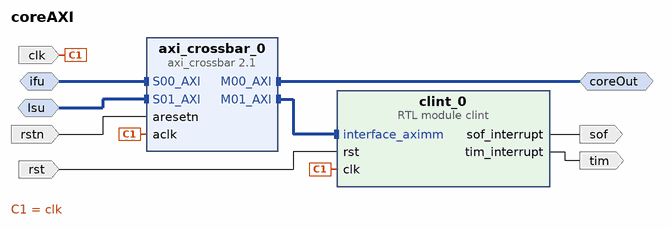
[diagram p0: block diagram of the top level]
# Vivado block design coreAXI, xc7a100tfgg484-1, Vivado 2023.2
create_bd_design coreAXI

create_bd_intf_port -mode Slave -vlnv xilinx.com:interface:aximm_rtl:1.0 ifu
set_property -dict [list \
  CONFIG.ADDR_WIDTH 32 \
  CONFIG.ARUSER_WIDTH 0 \
  CONFIG.AWUSER_WIDTH 0 \
  CONFIG.BUSER_WIDTH 0 \
  CONFIG.DATA_WIDTH 32 \
  CONFIG.FREQ_HZ 50000000 \
  CONFIG.HAS_BRESP 0 \
  CONFIG.HAS_BURST 0 \
  CONFIG.HAS_CACHE 0 \
  CONFIG.HAS_LOCK 0 \
  CONFIG.HAS_PROT 0 \
  CONFIG.HAS_QOS 0 \
  CONFIG.HAS_REGION 0 \
  CONFIG.HAS_RRESP 0 \
  CONFIG.HAS_WSTRB 1 \
  CONFIG.ID_WIDTH 0 \
  CONFIG.MAX_BURST_LENGTH 1 \
  CONFIG.NUM_READ_OUTSTANDING 0 \
  CONFIG.NUM_READ_THREADS 1 \
  CONFIG.NUM_WRITE_OUTSTANDING 0 \
  CONFIG.NUM_WRITE_THREADS 1 \
  CONFIG.PROTOCOL AXI4LITE \
  CONFIG.READ_WRITE_MODE READ_ONLY \
  CONFIG.RUSER_BITS_PER_BYTE 0 \
  CONFIG.RUSER_WIDTH 0 \
  CONFIG.SUPPORTS_NARROW_BURST 0 \
  CONFIG.WUSER_BITS_PER_BYTE 0 \
  CONFIG.WUSER_WIDTH 0 \
] [get_bd_intf_ports ifu]
create_bd_intf_port -mode Slave -vlnv xilinx.com:interface:aximm_rtl:1.0 lsu
set_property -dict [list \
  CONFIG.ADDR_WIDTH 32 \
  CONFIG.ARUSER_WIDTH 0 \
  CONFIG.AWUSER_WIDTH 0 \
  CONFIG.BUSER_WIDTH 0 \
  CONFIG.DATA_WIDTH 32 \
  CONFIG.FREQ_HZ 50000000 \
  CONFIG.HAS_BRESP 0 \
  CONFIG.HAS_BURST 0 \
  CONFIG.HAS_CACHE 0 \
  CONFIG.HAS_LOCK 0 \
  CONFIG.HAS_PROT 0 \
  CONFIG.HAS_QOS 0 \
  CONFIG.HAS_REGION 0 \
  CONFIG.HAS_RRESP 0 \
  CONFIG.HAS_WSTRB 1 \
  CONFIG.ID_WIDTH 0 \
  CONFIG.MAX_BURST_LENGTH 1 \
  CONFIG.NUM_READ_OUTSTANDING 0 \
  CONFIG.NUM_READ_THREADS 1 \
  CONFIG.NUM_WRITE_OUTSTANDING 0 \
  CONFIG.NUM_WRITE_THREADS 1 \
  CONFIG.PROTOCOL AXI4LITE \
  CONFIG.READ_WRITE_MODE READ_WRITE \
  CONFIG.RUSER_BITS_PER_BYTE 0 \
  CONFIG.RUSER_WIDTH 0 \
  CONFIG.SUPPORTS_NARROW_BURST 0 \
  CONFIG.WUSER_BITS_PER_BYTE 0 \
  CONFIG.WUSER_WIDTH 0 \
] [get_bd_intf_ports lsu]
create_bd_intf_port -mode Master -vlnv xilinx.com:interface:aximm_rtl:1.0 coreOut
set_property -dict [list \
  CONFIG.ADDR_WIDTH 32 \
  CONFIG.DATA_WIDTH 32 \
  CONFIG.FREQ_HZ 50000000 \
  CONFIG.HAS_BRESP 0 \
  CONFIG.HAS_PROT 0 \
  CONFIG.HAS_RRESP 0 \
  CONFIG.NUM_READ_OUTSTANDING 0 \
  CONFIG.NUM_WRITE_OUTSTANDING 0 \
  CONFIG.PROTOCOL AXI4LITE \
] [get_bd_intf_ports coreOut]
create_bd_port -dir I -type clk clk
set_property -dict {CONFIG.FREQ_HZ 50000000} [get_bd_ports clk]
create_bd_port -dir I -type rst rstn
create_bd_port -dir O sof
create_bd_port -dir O tim
create_bd_port -dir I -type rst rst
set_property -dict {CONFIG.POLARITY ACTIVE_HIGH} [get_bd_ports rst]

create_bd_cell -type ip -vlnv xilinx.com:ip:axi_crossbar:2.1 axi_crossbar_0
set_property -dict [list \
  CONFIG.M00_A02_BASE_ADDR 0xffffffffffffffff \
  CONFIG.M00_A03_BASE_ADDR 0xffffffffffffffff \
  CONFIG.M00_A04_BASE_ADDR 0xffffffffffffffff \
  CONFIG.M00_A05_BASE_ADDR 0xffffffffffffffff \
  CONFIG.M00_A06_BASE_ADDR 0xffffffffffffffff \
  CONFIG.M00_A07_BASE_ADDR 0xffffffffffffffff \
  CONFIG.M00_A08_BASE_ADDR 0xffffffffffffffff \
  CONFIG.M00_A09_BASE_ADDR 0xffffffffffffffff \
  CONFIG.M00_A10_BASE_ADDR 0xffffffffffffffff \
  CONFIG.M00_A11_BASE_ADDR 0xffffffffffffffff \
  CONFIG.M00_A12_BASE_ADDR 0xffffffffffffffff \
  CONFIG.M00_A13_BASE_ADDR 0xffffffffffffffff \
  CONFIG.M00_A14_BASE_ADDR 0xffffffffffffffff \
  CONFIG.M00_A15_BASE_ADDR 0xffffffffffffffff \
  CONFIG.M01_A01_BASE_ADDR 0xffffffffffffffff \
  CONFIG.M01_A02_BASE_ADDR 0xffffffffffffffff \
  CONFIG.M01_A03_BASE_ADDR 0xffffffffffffffff \
  CONFIG.M01_A04_BASE_ADDR 0xffffffffffffffff \
  CONFIG.M01_A05_BASE_ADDR 0xffffffffffffffff \
  CONFIG.M01_A06_BASE_ADDR 0xffffffffffffffff \
  CONFIG.M01_A07_BASE_ADDR 0xffffffffffffffff \
  CONFIG.M01_A08_BASE_ADDR 0xffffffffffffffff \
  CONFIG.M01_A09_BASE_ADDR 0xffffffffffffffff \
  CONFIG.M01_A10_BASE_ADDR 0xffffffffffffffff \
  CONFIG.M01_A11_BASE_ADDR 0xffffffffffffffff \
  CONFIG.M01_A12_BASE_ADDR 0xffffffffffffffff \
  CONFIG.M01_A13_BASE_ADDR 0xffffffffffffffff \
  CONFIG.M01_A14_BASE_ADDR 0xffffffffffffffff \
  CONFIG.M01_A15_BASE_ADDR 0xffffffffffffffff \
  CONFIG.M02_A00_ADDR_WIDTH 0 \
  CONFIG.M02_A00_BASE_ADDR 0xffffffffffffffff \
  CONFIG.M02_A01_BASE_ADDR 0xffffffffffffffff \
  CONFIG.M02_A02_BASE_ADDR 0xffffffffffffffff \
  CONFIG.M02_A03_BASE_ADDR 0xffffffffffffffff \
  CONFIG.M02_A04_BASE_ADDR 0xffffffffffffffff \
  CONFIG.M02_A05_BASE_ADDR 0xffffffffffffffff \
  CONFIG.M02_A06_BASE_ADDR 0xffffffffffffffff \
  CONFIG.M02_A07_BASE_ADDR 0xffffffffffffffff \
  CONFIG.M02_A08_BASE_ADDR 0xffffffffffffffff \
  CONFIG.M02_A09_BASE_ADDR 0xffffffffffffffff \
  CONFIG.M02_A10_BASE_ADDR 0xffffffffffffffff \
  CONFIG.M02_A11_BASE_ADDR 0xffffffffffffffff \
  CONFIG.M02_A12_BASE_ADDR 0xffffffffffffffff \
  CONFIG.M02_A13_BASE_ADDR 0xffffffffffffffff \
  CONFIG.M02_A14_BASE_ADDR 0xffffffffffffffff \
  CONFIG.M02_A15_BASE_ADDR 0xffffffffffffffff \
  CONFIG.M02_READ_ISSUING 1 \
  CONFIG.M02_WRITE_ISSUING 1 \
  CONFIG.M03_A00_ADDR_WIDTH 0 \
  CONFIG.M03_A00_BASE_ADDR 0xffffffffffffffff \
  CONFIG.M03_A01_BASE_ADDR 0xffffffffffffffff \
  CONFIG.M03_A02_BASE_ADDR 0xffffffffffffffff \
  CONFIG.M03_A03_BASE_ADDR 0xffffffffffffffff \
  CONFIG.M03_A04_BASE_ADDR 0xffffffffffffffff \
  CONFIG.M03_A05_BASE_ADDR 0xffffffffffffffff \
  CONFIG.M03_A06_BASE_ADDR 0xffffffffffffffff \
  CONFIG.M03_A07_BASE_ADDR 0xffffffffffffffff \
  CONFIG.M03_A08_BASE_ADDR 0xffffffffffffffff \
  CONFIG.M03_A09_BASE_ADDR 0xffffffffffffffff \
  CONFIG.M03_A10_BASE_ADDR 0xffffffffffffffff \
  CONFIG.M03_A11_BASE_ADDR 0xffffffffffffffff \
  CONFIG.M03_A12_BASE_ADDR 0xffffffffffffffff \
  CONFIG.M03_A13_BASE_ADDR 0xffffffffffffffff \
  CONFIG.M03_A14_BASE_ADDR 0xffffffffffffffff \
  CONFIG.M03_A15_BASE_ADDR 0xffffffffffffffff \
  CONFIG.M03_READ_ISSUING 1 \
  CONFIG.M03_WRITE_ISSUING 1 \
  CONFIG.M04_A00_ADDR_WIDTH 0 \
  CONFIG.M04_A00_BASE_ADDR 0xffffffffffffffff \
  CONFIG.M04_A01_BASE_ADDR 0xffffffffffffffff \
  CONFIG.M04_A02_BASE_ADDR 0xffffffffffffffff \
  CONFIG.M04_A03_BASE_ADDR 0xffffffffffffffff \
  CONFIG.M04_A04_BASE_ADDR 0xffffffffffffffff \
  CONFIG.M04_A05_BASE_ADDR 0xffffffffffffffff \
  CONFIG.M04_A06_BASE_ADDR 0xffffffffffffffff \
  CONFIG.M04_A07_BASE_ADDR 0xffffffffffffffff \
  CONFIG.M04_A08_BASE_ADDR 0xffffffffffffffff \
  CONFIG.M04_A09_BASE_ADDR 0xffffffffffffffff \
  CONFIG.M04_A10_BASE_ADDR 0xffffffffffffffff \
  CONFIG.M04_A11_BASE_ADDR 0xffffffffffffffff \
  CONFIG.M04_A12_BASE_ADDR 0xffffffffffffffff \
  CONFIG.M04_A13_BASE_ADDR 0xffffffffffffffff \
  CONFIG.M04_A14_BASE_ADDR 0xffffffffffffffff \
  CONFIG.M04_A15_BASE_ADDR 0xffffffffffffffff \
  CONFIG.M04_READ_ISSUING 1 \
  CONFIG.M04_WRITE_ISSUING 1 \
  CONFIG.M05_A00_ADDR_WIDTH 0 \
  CONFIG.M05_A00_BASE_ADDR 0xffffffffffffffff \
  CONFIG.M05_A01_BASE_ADDR 0xffffffffffffffff \
  CONFIG.M05_A02_BASE_ADDR 0xffffffffffffffff \
  CONFIG.M05_A03_BASE_ADDR 0xffffffffffffffff \
  CONFIG.M05_A04_BASE_ADDR 0xffffffffffffffff \
  CONFIG.M05_A05_BASE_ADDR 0xffffffffffffffff \
  CONFIG.M05_A06_BASE_ADDR 0xffffffffffffffff \
  CONFIG.M05_A07_BASE_ADDR 0xffffffffffffffff \
  CONFIG.M05_A08_BASE_ADDR 0xffffffffffffffff \
  CONFIG.M05_A09_BASE_ADDR 0xffffffffffffffff \
  CONFIG.M05_A10_BASE_ADDR 0xffffffffffffffff \
  CONFIG.M05_A11_BASE_ADDR 0xffffffffffffffff \
  CONFIG.M05_A12_BASE_ADDR 0xffffffffffffffff \
  CONFIG.M05_A13_BASE_ADDR 0xffffffffffffffff \
  CONFIG.M05_A14_BASE_ADDR 0xffffffffffffffff \
  CONFIG.M05_A15_BASE_ADDR 0xffffffffffffffff \
  CONFIG.M05_READ_ISSUING 1 \
  CONFIG.M05_WRITE_ISSUING 1 \
  CONFIG.M06_A00_ADDR_WIDTH 0 \
  CONFIG.M06_A00_BASE_ADDR 0xffffffffffffffff \
  CONFIG.M06_A01_BASE_ADDR 0xffffffffffffffff \
  CONFIG.M06_A02_BASE_ADDR 0xffffffffffffffff \
  CONFIG.M06_A03_BASE_ADDR 0xffffffffffffffff \
  CONFIG.M06_A04_BASE_ADDR 0xffffffffffffffff \
  CONFIG.M06_A05_BASE_ADDR 0xffffffffffffffff \
  CONFIG.M06_A06_BASE_ADDR 0xffffffffffffffff \
  CONFIG.M06_A07_BASE_ADDR 0xffffffffffffffff \
  CONFIG.M06_A08_BASE_ADDR 0xffffffffffffffff \
  CONFIG.M06_A09_BASE_ADDR 0xffffffffffffffff \
  CONFIG.M06_A10_BASE_ADDR 0xffffffffffffffff \
  CONFIG.M06_A11_BASE_ADDR 0xffffffffffffffff \
  CONFIG.M06_A12_BASE_ADDR 0xffffffffffffffff \
  CONFIG.M06_A13_BASE_ADDR 0xffffffffffffffff \
  CONFIG.M06_A14_BASE_ADDR 0xffffffffffffffff \
  CONFIG.M06_A15_BASE_ADDR 0xffffffffffffffff \
  CONFIG.M06_READ_ISSUING 1 \
  CONFIG.M06_WRITE_ISSUING 1 \
  CONFIG.M07_A00_ADDR_WIDTH 0 \
  CONFIG.M07_A00_BASE_ADDR 0xffffffffffffffff \
  CONFIG.M07_A01_BASE_ADDR 0xffffffffffffffff \
  CONFIG.M07_A02_BASE_ADDR 0xffffffffffffffff \
  CONFIG.M07_A03_BASE_ADDR 0xffffffffffffffff \
  CONFIG.M07_A04_BASE_ADDR 0xffffffffffffffff \
  CONFIG.M07_A05_BASE_ADDR 0xffffffffffffffff \
  CONFIG.M07_A06_BASE_ADDR 0xffffffffffffffff \
  CONFIG.M07_A07_BASE_ADDR 0xffffffffffffffff \
  CONFIG.M07_A08_BASE_ADDR 0xffffffffffffffff \
  CONFIG.M07_A09_BASE_ADDR 0xffffffffffffffff \
  CONFIG.M07_A10_BASE_ADDR 0xffffffffffffffff \
  CONFIG.M07_A11_BASE_ADDR 0xffffffffffffffff \
  CONFIG.M07_A12_BASE_ADDR 0xffffffffffffffff \
  CONFIG.M07_A13_BASE_ADDR 0xffffffffffffffff \
  CONFIG.M07_A14_BASE_ADDR 0xffffffffffffffff \
  CONFIG.M07_A15_BASE_ADDR 0xffffffffffffffff \
  CONFIG.M07_READ_ISSUING 1 \
  CONFIG.M07_WRITE_ISSUING 1 \
  CONFIG.M08_A00_ADDR_WIDTH 0 \
  CONFIG.M08_A00_BASE_ADDR 0xffffffffffffffff \
  CONFIG.M08_A01_BASE_ADDR 0xffffffffffffffff \
  CONFIG.M08_A02_BASE_ADDR 0xffffffffffffffff \
  CONFIG.M08_A03_BASE_ADDR 0xffffffffffffffff \
  CONFIG.M08_A04_BASE_ADDR 0xffffffffffffffff \
  CONFIG.M08_A05_BASE_ADDR 0xffffffffffffffff \
  CONFIG.M08_A06_BASE_ADDR 0xffffffffffffffff \
  CONFIG.M08_A07_BASE_ADDR 0xffffffffffffffff \
  CONFIG.M08_A08_BASE_ADDR 0xffffffffffffffff \
  CONFIG.M08_A09_BASE_ADDR 0xffffffffffffffff \
  CONFIG.M08_A10_BASE_ADDR 0xffffffffffffffff \
  CONFIG.M08_A11_BASE_ADDR 0xffffffffffffffff \
  CONFIG.M08_A12_BASE_ADDR 0xffffffffffffffff \
  CONFIG.M08_A13_BASE_ADDR 0xffffffffffffffff \
  CONFIG.M08_A14_BASE_ADDR 0xffffffffffffffff \
  CONFIG.M08_A15_BASE_ADDR 0xffffffffffffffff \
  CONFIG.M08_READ_ISSUING 1 \
  CONFIG.M08_WRITE_ISSUING 1 \
  CONFIG.M09_A00_ADDR_WIDTH 0 \
  CONFIG.M09_A00_BASE_ADDR 0xffffffffffffffff \
  CONFIG.M09_A01_BASE_ADDR 0xffffffffffffffff \
  CONFIG.M09_A02_BASE_ADDR 0xffffffffffffffff \
  CONFIG.M09_A03_BASE_ADDR 0xffffffffffffffff \
  CONFIG.M09_A04_BASE_ADDR 0xffffffffffffffff \
  CONFIG.M09_A05_BASE_ADDR 0xffffffffffffffff \
  CONFIG.M09_A06_BASE_ADDR 0xffffffffffffffff \
  CONFIG.M09_A07_BASE_ADDR 0xffffffffffffffff \
  CONFIG.M09_A08_BASE_ADDR 0xffffffffffffffff \
  CONFIG.M09_A09_BASE_ADDR 0xffffffffffffffff \
  CONFIG.M09_A10_BASE_ADDR 0xffffffffffffffff \
  CONFIG.M09_A11_BASE_ADDR 0xffffffffffffffff \
  CONFIG.M09_A12_BASE_ADDR 0xffffffffffffffff \
  CONFIG.M09_A13_BASE_ADDR 0xffffffffffffffff \
  CONFIG.M09_A14_BASE_ADDR 0xffffffffffffffff \
  CONFIG.M09_A15_BASE_ADDR 0xffffffffffffffff \
  CONFIG.M09_READ_ISSUING 1 \
  CONFIG.M09_WRITE_ISSUING 1 \
  CONFIG.M10_A00_ADDR_WIDTH 0 \
  CONFIG.M10_A00_BASE_ADDR 0xffffffffffffffff \
  CONFIG.M10_A01_BASE_ADDR 0xffffffffffffffff \
  CONFIG.M10_A02_BASE_ADDR 0xffffffffffffffff \
  CONFIG.M10_A03_BASE_ADDR 0xffffffffffffffff \
  CONFIG.M10_A04_BASE_ADDR 0xffffffffffffffff \
  CONFIG.M10_A05_BASE_ADDR 0xffffffffffffffff \
  CONFIG.M10_A06_BASE_ADDR 0xffffffffffffffff \
  CONFIG.M10_A07_BASE_ADDR 0xffffffffffffffff \
  CONFIG.M10_A08_BASE_ADDR 0xffffffffffffffff \
  CONFIG.M10_A09_BASE_ADDR 0xffffffffffffffff \
  CONFIG.M10_A10_BASE_ADDR 0xffffffffffffffff \
  CONFIG.M10_A11_BASE_ADDR 0xffffffffffffffff \
  CONFIG.M10_A12_BASE_ADDR 0xffffffffffffffff \
  CONFIG.M10_A13_BASE_ADDR 0xffffffffffffffff \
  CONFIG.M10_A14_BASE_ADDR 0xffffffffffffffff \
  CONFIG.M10_A15_BASE_ADDR 0xffffffffffffffff \
  CONFIG.M10_READ_ISSUING 1 \
  CONFIG.M10_WRITE_ISSUING 1 \
  CONFIG.M11_A00_ADDR_WIDTH 0 \
  CONFIG.M11_A00_BASE_ADDR 0xffffffffffffffff \
  CONFIG.M11_A01_BASE_ADDR 0xffffffffffffffff \
  CONFIG.M11_A02_BASE_ADDR 0xffffffffffffffff \
  CONFIG.M11_A03_BASE_ADDR 0xffffffffffffffff \
  CONFIG.M11_A04_BASE_ADDR 0xffffffffffffffff \
  CONFIG.M11_A05_BASE_ADDR 0xffffffffffffffff \
  CONFIG.M11_A06_BASE_ADDR 0xffffffffffffffff \
  CONFIG.M11_A07_BASE_ADDR 0xffffffffffffffff \
  CONFIG.M11_A08_BASE_ADDR 0xffffffffffffffff \
  CONFIG.M11_A09_BASE_ADDR 0xffffffffffffffff \
  CONFIG.M11_A10_BASE_ADDR 0xffffffffffffffff \
  CONFIG.M11_A11_BASE_ADDR 0xffffffffffffffff \
  CONFIG.M11_A12_BASE_ADDR 0xffffffffffffffff \
  CONFIG.M11_A13_BASE_ADDR 0xffffffffffffffff \
  CONFIG.M11_A14_BASE_ADDR 0xffffffffffffffff \
  CONFIG.M11_A15_BASE_ADDR 0xffffffffffffffff \
  CONFIG.M11_READ_ISSUING 1 \
  CONFIG.M11_WRITE_ISSUING 1 \
  CONFIG.M12_A00_ADDR_WIDTH 0 \
  CONFIG.M12_A00_BASE_ADDR 0xffffffffffffffff \
  CONFIG.M12_A01_BASE_ADDR 0xffffffffffffffff \
  CONFIG.M12_A02_BASE_ADDR 0xffffffffffffffff \
  CONFIG.M12_A03_BASE_ADDR 0xffffffffffffffff \
  CONFIG.M12_A04_BASE_ADDR 0xffffffffffffffff \
  CONFIG.M12_A05_BASE_ADDR 0xffffffffffffffff \
  CONFIG.M12_A06_BASE_ADDR 0xffffffffffffffff \
  CONFIG.M12_A07_BASE_ADDR 0xffffffffffffffff \
  CONFIG.M12_A08_BASE_ADDR 0xffffffffffffffff \
  CONFIG.M12_A09_BASE_ADDR 0xffffffffffffffff \
  CONFIG.M12_A10_BASE_ADDR 0xffffffffffffffff \
  CONFIG.M12_A11_BASE_ADDR 0xffffffffffffffff \
  CONFIG.M12_A12_BASE_ADDR 0xffffffffffffffff \
  CONFIG.M12_A13_BASE_ADDR 0xffffffffffffffff \
  CONFIG.M12_A14_BASE_ADDR 0xffffffffffffffff \
  CONFIG.M12_A15_BASE_ADDR 0xffffffffffffffff \
  CONFIG.M12_READ_ISSUING 1 \
  CONFIG.M12_WRITE_ISSUING 1 \
  CONFIG.M13_A00_ADDR_WIDTH 0 \
  CONFIG.M13_A00_BASE_ADDR 0xffffffffffffffff \
  CONFIG.M13_A01_BASE_ADDR 0xffffffffffffffff \
  CONFIG.M13_A02_BASE_ADDR 0xffffffffffffffff \
  CONFIG.M13_A03_BASE_ADDR 0xffffffffffffffff \
  CONFIG.M13_A04_BASE_ADDR 0xffffffffffffffff \
  CONFIG.M13_A05_BASE_ADDR 0xffffffffffffffff \
  CONFIG.M13_A06_BASE_ADDR 0xffffffffffffffff \
  CONFIG.M13_A07_BASE_ADDR 0xffffffffffffffff \
  CONFIG.M13_A08_BASE_ADDR 0xffffffffffffffff \
  CONFIG.M13_A09_BASE_ADDR 0xffffffffffffffff \
  CONFIG.M13_A10_BASE_ADDR 0xffffffffffffffff \
  CONFIG.M13_A11_BASE_ADDR 0xffffffffffffffff \
  CONFIG.M13_A12_BASE_ADDR 0xffffffffffffffff \
  CONFIG.M13_A13_BASE_ADDR 0xffffffffffffffff \
  CONFIG.M13_A14_BASE_ADDR 0xffffffffffffffff \
  CONFIG.M13_A15_BASE_ADDR 0xffffffffffffffff \
  CONFIG.M13_READ_ISSUING 1 \
  CONFIG.M13_WRITE_ISSUING 1 \
  CONFIG.M14_A00_ADDR_WIDTH 0 \
  CONFIG.M14_A00_BASE_ADDR 0xffffffffffffffff \
  CONFIG.M14_A01_BASE_ADDR 0xffffffffffffffff \
  CONFIG.M14_A02_BASE_ADDR 0xffffffffffffffff \
  CONFIG.M14_A03_BASE_ADDR 0xffffffffffffffff \
  CONFIG.M14_A04_BASE_ADDR 0xffffffffffffffff \
  CONFIG.M14_A05_BASE_ADDR 0xffffffffffffffff \
  CONFIG.M14_A06_BASE_ADDR 0xffffffffffffffff \
  CONFIG.M14_A07_BASE_ADDR 0xffffffffffffffff \
  CONFIG.M14_A08_BASE_ADDR 0xffffffffffffffff \
  CONFIG.M14_A09_BASE_ADDR 0xffffffffffffffff \
  CONFIG.M14_A10_BASE_ADDR 0xffffffffffffffff \
  CONFIG.M14_A11_BASE_ADDR 0xffffffffffffffff \
  CONFIG.M14_A12_BASE_ADDR 0xffffffffffffffff \
  CONFIG.M14_A13_BASE_ADDR 0xffffffffffffffff \
  CONFIG.M14_A14_BASE_ADDR 0xffffffffffffffff \
  CONFIG.M14_A15_BASE_ADDR 0xffffffffffffffff \
  CONFIG.M14_READ_ISSUING 1 \
  CONFIG.M14_WRITE_ISSUING 1 \
  CONFIG.M15_A00_ADDR_WIDTH 0 \
  CONFIG.M15_A00_BASE_ADDR 0xffffffffffffffff \
  CONFIG.M15_A01_BASE_ADDR 0xffffffffffffffff \
  CONFIG.M15_A02_BASE_ADDR 0xffffffffffffffff \
  CONFIG.M15_A03_BASE_ADDR 0xffffffffffffffff \
  CONFIG.M15_A04_BASE_ADDR 0xffffffffffffffff \
  CONFIG.M15_A05_BASE_ADDR 0xffffffffffffffff \
  CONFIG.M15_A06_BASE_ADDR 0xffffffffffffffff \
  CONFIG.M15_A07_BASE_ADDR 0xffffffffffffffff \
  CONFIG.M15_A08_BASE_ADDR 0xffffffffffffffff \
  CONFIG.M15_A09_BASE_ADDR 0xffffffffffffffff \
  CONFIG.M15_A10_BASE_ADDR 0xffffffffffffffff \
  CONFIG.M15_A11_BASE_ADDR 0xffffffffffffffff \
  CONFIG.M15_A12_BASE_ADDR 0xffffffffffffffff \
  CONFIG.M15_A13_BASE_ADDR 0xffffffffffffffff \
  CONFIG.M15_A14_BASE_ADDR 0xffffffffffffffff \
  CONFIG.M15_A15_BASE_ADDR 0xffffffffffffffff \
  CONFIG.M15_READ_ISSUING 1 \
  CONFIG.M15_WRITE_ISSUING 1 \
  CONFIG.NUM_MI 2 \
  CONFIG.NUM_SI 2 \
  CONFIG.R_REGISTER 1 \
  CONFIG.S02_READ_ACCEPTANCE 1 \
  CONFIG.S02_WRITE_ACCEPTANCE 1 \
  CONFIG.S03_READ_ACCEPTANCE 1 \
  CONFIG.S03_WRITE_ACCEPTANCE 1 \
  CONFIG.S04_READ_ACCEPTANCE 1 \
  CONFIG.S04_WRITE_ACCEPTANCE 1 \
  CONFIG.S05_READ_ACCEPTANCE 1 \
  CONFIG.S05_WRITE_ACCEPTANCE 1 \
  CONFIG.S06_READ_ACCEPTANCE 1 \
  CONFIG.S06_WRITE_ACCEPTANCE 1 \
  CONFIG.S07_READ_ACCEPTANCE 1 \
  CONFIG.S07_WRITE_ACCEPTANCE 1 \
  CONFIG.S08_READ_ACCEPTANCE 1 \
  CONFIG.S08_WRITE_ACCEPTANCE 1 \
  CONFIG.S09_READ_ACCEPTANCE 1 \
  CONFIG.S09_WRITE_ACCEPTANCE 1 \
  CONFIG.S10_READ_ACCEPTANCE 1 \
  CONFIG.S10_WRITE_ACCEPTANCE 1 \
  CONFIG.S11_READ_ACCEPTANCE 1 \
  CONFIG.S11_WRITE_ACCEPTANCE 1 \
  CONFIG.S12_READ_ACCEPTANCE 1 \
  CONFIG.S12_WRITE_ACCEPTANCE 1 \
  CONFIG.S13_READ_ACCEPTANCE 1 \
  CONFIG.S13_WRITE_ACCEPTANCE 1 \
  CONFIG.S14_READ_ACCEPTANCE 1 \
  CONFIG.S14_WRITE_ACCEPTANCE 1 \
  CONFIG.S15_READ_ACCEPTANCE 1 \
  CONFIG.S15_WRITE_ACCEPTANCE 1 \
] [get_bd_cells axi_crossbar_0]
create_bd_cell -type module -reference clint clint_0

# ---- connections ----

connect_bd_intf_net [get_bd_intf_ports coreOut] [get_bd_intf_pins axi_crossbar_0/M00_AXI]
connect_bd_intf_net [get_bd_intf_pins axi_crossbar_0/M01_AXI] [get_bd_intf_pins clint_0/interface_aximm]
connect_bd_intf_net [get_bd_intf_ports ifu] [get_bd_intf_pins axi_crossbar_0/S00_AXI]
connect_bd_intf_net [get_bd_intf_ports lsu] [get_bd_intf_pins axi_crossbar_0/S01_AXI]
connect_bd_net [get_bd_pins clint_0/sof_interrupt] [get_bd_ports sof]
connect_bd_net [get_bd_pins clint_0/tim_interrupt] [get_bd_ports tim]
connect_bd_net [get_bd_ports clk] [get_bd_pins clint_0/clk] [get_bd_pins axi_crossbar_0/aclk]
connect_bd_net [get_bd_ports rst] [get_bd_pins clint_0/rst]
connect_bd_net [get_bd_ports rstn] [get_bd_pins axi_crossbar_0/aresetn]

# ---- address map ----
assign_bd_address -offset 0x10000000 -range 128 -target_address_space [get_bd_addr_spaces ifu] [get_bd_addr_segs clint_0/interface_aximm/reg0]
assign_bd_address -offset 0x40000000 -range 2G -target_address_space [get_bd_addr_spaces ifu] [get_bd_addr_segs coreOut/Reg]
assign_bd_address -offset 0x10000000 -range 128 -target_address_space [get_bd_addr_spaces lsu] [get_bd_addr_segs clint_0/interface_aximm/reg0]
assign_bd_address -offset 0x40000000 -range 2G -target_address_space [get_bd_addr_spaces lsu] [get_bd_addr_segs coreOut/Reg]

validate_bd_design
save_bd_design
